# Altium project AGC_AD8317_ADL5330.PrjPcb
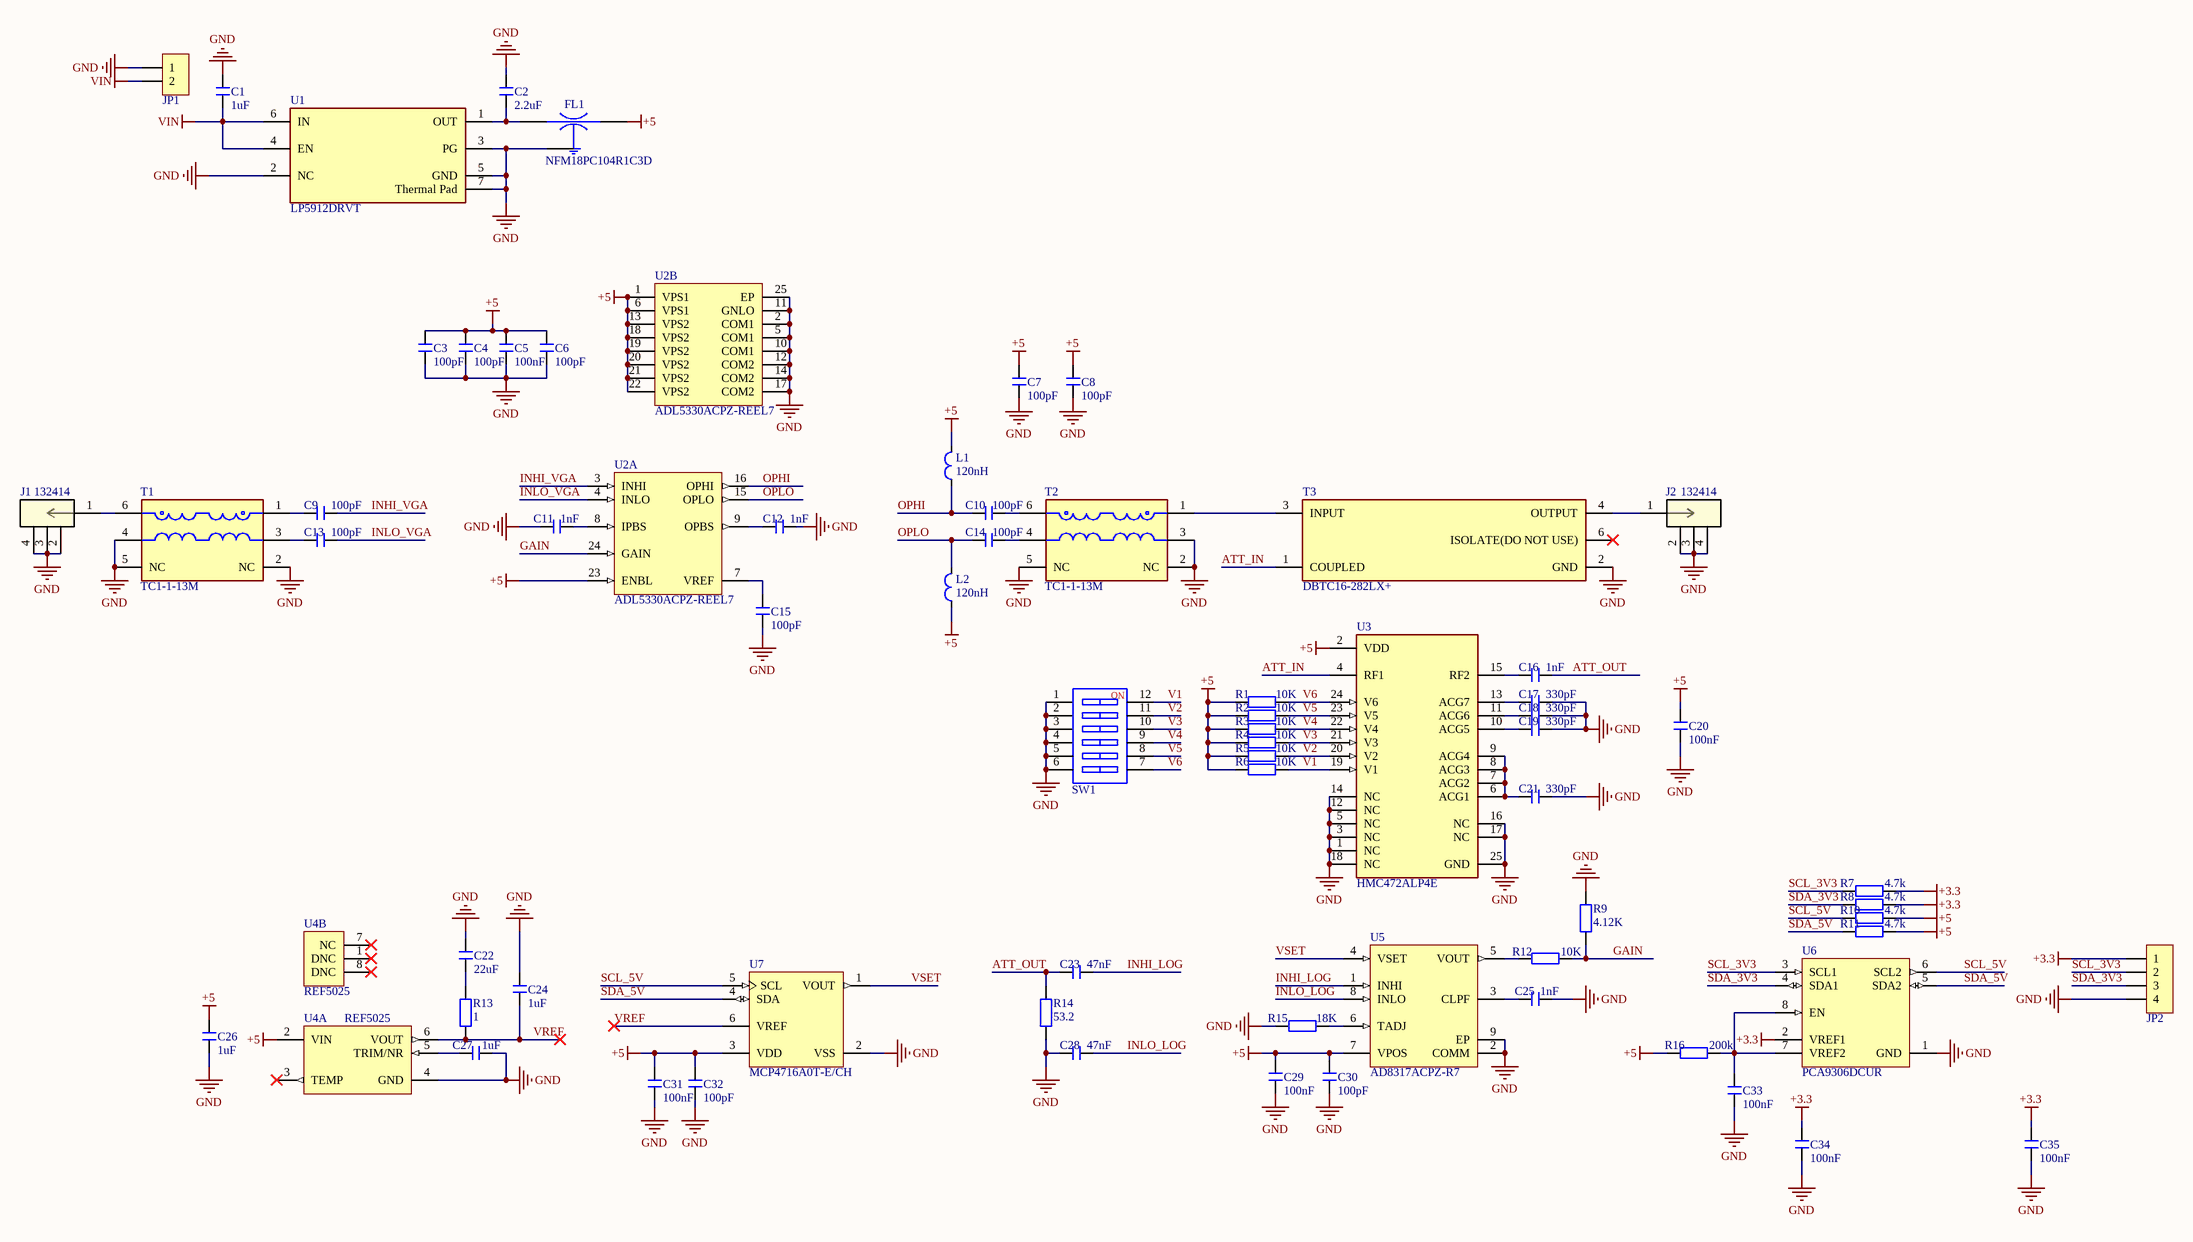
[diagram p0: AGC_AD8317_ADL5330.SchDoc]
1 sheet, 69 parts. Net scope: global (net labels, ports and power ports of the same name join across sheets).
Board file: AGC_AD8317_ADL5330.PcbDoc

## Sheet AGC_AD8317_ADL5330.SchDoc
size A2; SheetNumber: 1; SheetTotal: 1

### Parts
C1  1uF  [C 0402_L]
C2  2.2uF  [C 0603_L]
C3  100pF  [C 0402_L]
C4  100pF  [C 0402_L]
C5  100nF  [C 0402_L]
C6  100pF  [C 0402_L]
C7  100pF  [C 0402_L]
C8  100pF  [C 0402_L]
C9  100pF  [C 0402_L]
C10  100pF  [C 0402_L]
C11  1nF  [C 0402_L]
C12  1nF  [C 0402_L]
C13  100pF  [C 0402_L]
C14  100pF  [C 0402_L]
C15  100pF  [C 0402_L]
C16  1nF  [C 0402_L]
C17  330pF  [C 0402_L]
C18  330pF  [C 0402_L]
C19  330pF  [C 0402_L]
C20  100nF  [C 0402_L]
C21  330pF  [C 0402_L]
C22  22uF  [C 1210_L]
C23  47nF  [C 0402_L]
C24  1uF  [C 0402_L]
C25  1nF  [C 0402_L]
C26  1uF  [C 0402_L]
C27  1uF  [C 0402_L]
C28  47nF  [C 0402_L]
C29  100nF  [C 0402_L]
C30  100pF  [C 0402_L]
C31  100nF  [C 0402_L]
C32  100pF  [C 0402_L]
C33  100nF  [C 0402_L]
C34  100nF  [C 0402_L]
C35  100nF  [C 0402_L]
FL1  NFM18PC104R1C3D  [FIL_NFM18PC104R1C3D]
J1  132414  [CONN_132414_AMP]
J2  132414  [CONN_132414_AMP]
JP1  HDR-1X2  [KF2510-LI-2P]  (value not drawn)
JP2  HDR-1X4  [HDR2.54-LI-4P]  (value not drawn)
L1  120nH  [R 0603_L]
L2  120nH  [R 0603_L]
R1  10K  [R 0402_L]
R2  10K  [R 0402_L]
R3  10K  [R 0402_L]
R4  10K  [R 0402_L]
R5  10K  [R 0402_L]
R6  10K  [R 0402_L]
R7  4.7k  [R 0402_L]
R8  4.7k  [R 0402_L]
R9  4.12K  [R 0402_L]
R10  4.7k  [R 0402_L]
R11  4.7k  [R 0402_L]
R12  10K  [R 0402_L]
R13  1  [R 0402_L]
R14  53.2  [R 0402_L]
R15  18K  [R 0402_L]
R16  200k  [R 0402_L]
SW1  SW-6P  [CSW1.27 SMD-6P]  (value not drawn)
T1  TC1-1-13M  [FP-TC1-1-13M+-MFG]
T2  TC1-1-13M  [FP-TC1-1-13M+-MFG]
T3  DBTC16-282LX+  [FP-DBTC16-282LX+-MFG]
U1  LP5912DRVT  [FP-DRV0006A-MFG]
U2  ADL5330ACPZ-REEL7  [ADI-CP-24-2_L]  (parts A,B of 2)
U3  HMC472ALP4E  [FP-HMC472ALP4E-IPC_A]
U4  REF5025  [D0008A_L]  (parts A,B of 2)
U5  AD8317ACPZ-R7  [ADI-CP-8-1_L]
U6  PCA9306DCUR  [DCU0008A_L]
U7  MCP4716A0T-E/CH  [SOT23-6L]

### Nets
+3.3: C34.2 C35.2 JP2.1 R7.1 R8.1 U6.2(VREF1)
+5: C3.2 C4.2 C5.2 C6.2 C7.2 C8.2 C20.2 C26.2 C29.1 C30.1 C31.2 C32.2 FL1.3(OUT) L1.2 L2.1 R1.1 R2.1 R3.1 R4.1 R5.1 R6.1 R10.1 R11.1 R16.2 U2.1(VPS1) U2.6(VPS1) U2.13(VPS2) U2.18(VPS2) U2.19(VPS2) U2.20(VPS2) U2.21(VPS2) U2.22(VPS2) U2.23(ENBL) U3.2(VDD) U4.2(VIN) U5.7(VPOS) U7.3(VDD)
GND: C1.2 C2.2 C3.1 C4.1 C5.1 C6.1 C7.1 C8.1 C11.1 C12.1 C15.1 C17.2 C18.2 C19.2 C20.1 C21.2 C22.2 C24.2 C25.1 C26.1 C27.2 C28.1 C29.2 C30.2 C31.1 C32.1 C33.1 C34.1 C35.1 FL1.2(GND) J1.2 J1.3 J1.4 J2.2 J2.3 J2.4 JP1.1 JP2.4 R9.1 R14.1 R15.1 SW1.1 SW1.2 SW1.3 SW1.4 SW1.5 SW1.6 T1.2(NC) T1.4(PRIMARY) T1.5(NC) T2.2(NC) T2.3(SECONDARY) T2.5(NC) T3.2(GND) U1.2(NC) U1.3(PG) U1.5(GND) U1.7(Thermal_Pad) U2.2(COM1) U2.5(COM1) U2.10(COM1) U2.11(GNLO) U2.12(COM2) U2.14(COM2) U2.17(COM2) U2.25(EP) U3.1(NC) U3.3(NC) U3.5(NC) U3.12(NC) U3.14(NC) U3.16(NC) U3.17(NC) U3.18(NC) U3.25(GND) U4.4(GND) U5.2(COMM) U5.9(EP) U6.1(GND) U7.2(VSS)
VIN: C1.1 JP1.2 U1.4(EN) U1.6(IN)
ATT_IN: T3.1(COUPLED) U3.4(RF1)
ATT_OUT: C16.2 C23.1 R14.2
GAIN: R9.2 R12.1 U2.24(GAIN)
INHI_LOG: C23.2 U5.1(INHI)
INHI_VGA: C9.2 U2.3(INHI)
INLO_LOG: C28.2 U5.8(INLO)
INLO_VGA: C13.2 U2.4(INLO)
OPHI: C10.1 L1.1 U2.16(OPHI)
OPLO: C14.1 L2.2 U2.15(OPLO)
SCL_3V3: JP2.2 R7.2 U6.3(SCL1)
SCL_5V: R10.2 U6.6(SCL2) U7.5(SCL)
SDA_3V3: JP2.3 R8.2 U6.4(SDA1)
SDA_5V: R11.2 U6.5(SDA2) U7.4(SDA)
V1: R6.2 SW1.12 U3.19(V1)
V2: R5.2 SW1.11 U3.20(V2)
V3: R4.2 SW1.10 U3.21(V3)
V4: R3.2 SW1.9 U3.22(V4)
V5: R2.2 SW1.8 U3.23(V5)
V6: R1.2 SW1.7 U3.24(V6)
VREF: C24.1 R13.1 U4.6(VOUT) U7.6(VREF)
VSET: U5.4(VSET) U7.1(VOUT)
NetC2_1: C2.1 FL1.1(IN) U1.1(OUT)
NetC9_1: C9.1 T1.1(SECONDARY_DOT)
NetC10_2: C10.2 T2.6(PRIMARY_DOT)
NetC11_2: C11.2 U2.8(IPBS)
NetC12_2: C12.2 U2.9(OPBS)
NetC13_1: C13.1 T1.3(SECONDARY)
NetC14_2: C14.2 T2.4(PRIMARY)
NetC15_2: C15.2 U2.7(VREF)
NetC16_1: C16.1 U3.15(RF2)
NetC17_1: C17.1 U3.13(ACG7)
NetC18_1: C18.1 U3.11(ACG6)
NetC19_1: C19.1 U3.10(ACG5)
NetC21_1: C21.1 U3.6(ACG1) U3.7(ACG2) U3.8(ACG3) U3.9(ACG4)
NetC22_1: C22.1 R13.2
NetC25_2: C25.2 U5.3(CLPF)
NetC27_1: C27.1 U4.5(TRIM/NR)
NetC33_2: C33.2 R16.1 U6.7(VREF2) U6.8(EN)
NetJ1_1: J1.1 T1.6(PRIMARY_DOT)
NetJ2_1: J2.1 T3.4(OUTPUT)
NetR12_2: R12.2 U5.5(VOUT)
NetR15_2: R15.2 U5.6(TADJ)
NetT2_1: T2.1(SECONDARY_DOT) T3.3(INPUT)

Not connected (* = marked no-connect by the designer): T3 6(ISOLATE(DO_NOT_USE))*; U4 1(DNC)* 3(TEMP)* 7(NC)* 8(DNC)*

### Notes on the sheet
- (in symbol SW-6P) NO

### Library data of the parts
C1-C35 = C: 贴片电容; 淘宝ID: 小糖豆的小窝窝; BOM名称: 贴片电容; 下单链接: https://item.taobao.com/item.htm?ft=t&id=613637044352
FL1 = NFM18PC104R1C3D: SMD Capacitor with Capacitance: 0.10uF Tol. 20%. Rated Voltage: 16Vdc; MF: Murata; Digi-Key_Part_Number: 490-6969-1-ND; SnapEDA_Link: https://www.snapeda.com/parts/NFM18PC104R1C3D/Murata/view-part/4375738/?ref=snap; Package: NONSTANDARD; MP: NFM18PC104R1C3D; Digi-Key_Purchase_URL: https://www.digikey.com/product-detail/en/murata-electronics/NFM18PC104R1C3D/490-6969-1-ND/3846166?utm_source=snapeda&utm_medium=aggregator&utm_campaign=symbol; Value: *
J1 J2 = 132414: No Description Available; Mfr_Name: Amphenol ICC; Copyright: Copyright (C) 2022 Ultra Librarian. All rights reserved.; Manufacturer_Part_Number: 132414; RefDes: RefDes; Type: DEV
JP1 = Header 2: 2P接插件; 淘宝ID: 小糖豆的小窝窝; BOM名称: 2P接插件; 下单链接: https://item.taobao.com/item.htm?ft=t&id=613637044352
JP2 = Header 4: 4P接插件; 淘宝ID: 小糖豆的小窝窝; BOM名称: 4P接插件; 下单链接: https://item.taobao.com/item.htm?ft=t&id=613637044352
L1 L2 = L-Wire: 高频绕线电感
R1-R16 = R: 贴片电阻; 淘宝ID: 小糖豆的小窝窝; BOM名称: 贴片电阻; 下单链接: https://item.taobao.com/item.htm?ft=t&id=613637044352
SW1 = SW-6P: 6路编码开关; 淘宝ID: 小糖豆的小窝窝; BOM名称: 6路编码开关; 下单链接: https://item.taobao.com/item.htm?ft=t&id=613637044352
T1 T2 = TC1-1-13M: RF Transformer 1: 1 5 Terminal SMD; RoHS Compliant: Yes
T3 = DBTC16-282LX+: 16.8 dB SMT Directional Coupler, 5 - 2850 MHz, 50Ω
U1 = LP5912DRVT: IC REG LINEAR 500MA 6SON; Dropout Voltage: 950mV; Quiescent Current: 30uA; Output Voltage: 3.3V; Number of Regulators: 1; Min Operating Temperature: -40°C; Number of Pins: 6; Max Operating Temperature: 125°C; RoHS Compliant: Yes; Packaging: Tape and Reel; Output Current: 500mA; Mount: Surface Mount; Lead Free: Lead Free
U2 = ADL5330ACPZ: 10 MHz to 3 GHz VGA with 60 dB Gain Control Range, 3GHz, CP-24-2, 1500 Reel, Pb-Free; Output IP3: 31dBm; Gain High End: 22dB; Noise Figure: 14.7dB; Supply Current: 215mA; Gain Low End: -34dB; 1 dB Comp Point: 1.2dBm; PackageDescription: 24-Lead Lead Frame Chip Scale Package [LFCSP_VQ]; ComponentLink1Description: Manufacturer URL; ComponentLink1URL: www.analog.com; ComponentLink3Description: Package Specification; ComponentLink3URL: http://www.analog.com/static/imported-files/packages/588305704543880784658541CP_24_2.pdf; ComponentLink2Description: Datasheet; PackageVersion: Jan-2005; RF Frquency Range (MHz): 3GHz; ComponentLink2URL: http://www.analog.com/static/imported-files/data_sheets/ADL5330.pdf; PackageReference: CP-24-2; Code_JEDEC: MO-220-VGGD-2; DatasheetVersion: Rev. A
U3 = HMC472ALP4E: RF ATTENUATOR 31.5DB 50OHM 24QFN; Manufacturer: Analog Devices; Standoff Height: 0mm; Max Frequency: 3.8GHz; Temperature Range High: +85°C; Ipc Land Pattern Name: QFN50P400X400X90-24; Category: IC; Automotive: No; Package: LFCSP_VQ; Device Class L3: unset; Height: 1mm; Device Class L1: Integrated Circuits (ICs); Octopart: https://octopart.com/hmc472alp4e-analog+devices-51966954; Manufacturer Part Number: HMC472ALP4E; Lead Free: Yes; Device Class L2: RF Semiconductors and Devices; RoHS: TRUE; Footprint Url: https://www.analog.com/media/en/package-pcb-resources/package/pkg_pdf/hittite-legacy-packages/HCP-24-2.pdf; Temperature Range Low: -40°C; Mouser Description: Attenuators 6 Bit 0.5 LSB dig atten; Digikey Description: RF ATTENUATOR 31.5DB 50OHM 24QFN; ComponentLink2URL: https://www.analog.com/media/en/technical-documentation/data-sheets/hmc472a.pdf; Temperature: -40°C to +85°C; ComponentLink2Description: Datasheet
U4 = REF50: Low Noise, Very Low Drift, Precision Voltage Reference, -40 to 125 degC, 8-pin MSOP(DGK), Green (RoHS & no Sb/Br); PartNumber: REF5025AIDGKT; Manufacturer: Texas Instruments; Iout/Iz(Max)(mA): 10; VO(V): 2.5; Rating: Military; Iq(Max)(uA): 1000; SubFamily: Series Voltage Reference; VI(Max)(V): 18; VI(Min)(V): 2.7; Temp Coeff(Max)(ppm/ degree C): 3; Initial Accuracy @ 25/deg C(%): 0.05; Mounting Technology: Surface Mount; ComponentLink3Description: Package Specification; ComponentLink2URL: http://www.ti.com/general/docs/lit/getliterature.tsp?genericPartNumber=REF5025&fileType=pdf; Code_JEDEC: MO-187; PackageVersion: 4073329/E; ComponentLink1URL: http://www.ti.com/; DatasheetVersion: SBOS410E; Eco-Plan: Green (RoHS & no Sb/Br); ComponentLink2Description: Datasheet; ComponentLink3URL: http://www.ti.com/litv/pdf/mpds028d; PackageDescription: 8-Pin Thin Small Outline Package 3 x 3 mm Body ,0.65 mm Pitch; PackageReference: DGK0008A; ComponentLink1Description: Manufacturer URL
U5 = CMP-0284-00065-1: 1 MHz to 10 GHz, 55 dB Log Detector/Controller, 6ns Response Time, CP-8-1, Pb-Free, 3000 Reel; Product Description: Available in Die; Voltage Supply (V): 3 to 5.5; Temp Stability (dB): 500mdB; Dynamic Range (dB): 55dB; Supply Current: 22mA; RF Frequency (MHz): 1 to 10000; ComponentLink1Description: Manufacturer URL; PackageVersion: 031207-A; ComponentLink3Description: Package Specification; ComponentLink3URL: http://www.analog.com/static/imported-files/packages/PKG_PDF/LFCSP(CP)/CP-8/CP_8_1.pdf; ComponentLink1URL: www.analog.com; ComponentLink2URL: http://www.analog.com/static/imported-files/data_sheets/AD8317.pdf; PackageReference: CP-8-1; ComponentLink2Description: Datasheet; DatasheetVersion: Rev. B; Response Time (ns typ): 6ns; PackageDescription: 8-Lead Lead Frame Chip Scale Package [LFCSP_VD]
U6 = CMP-0314-00419-2: Dual Bi-Directional I2C-Bus and SMBus Voltage Level-Translator, 0 to 5.5 V, -40 to 85 degC, 8-pin US8 (DCU), Green (RoHS & no Sb/Br); Manufacturer: Texas Instruments; tpd max(ns): 1.5; Function: Voltage Translator; Enable Pin: Yes; Rating: Catalog; SubFamily: I2C Special Function; Max Frequency(kHz): 400; Vcc range(V): 0 to 5.5; No. of Outputs: 2; PackageVersion: revF, Jul-2005; Eco-Plan: Green (RoHS & no Sb/Br); ComponentLink2Description: Package Specification; ComponentLink1URL: http://www.ti.com/general/docs/lit/getliterature.tsp?genericPartNumber=PCA9306&fileType=pdf; DatasheetVersion: SCPS113J; On-Chip Power-on-Reset: No; PackageDescription: 8-Pin Thin Shrink Small Outline Package 0.5 mm Pitch; Code_JEDEC: MO-187-CA; PackageReference: DCU0008A; 5V Tolerant I/O: Yes; Open Drain I/O Type: Yes; Mounting Technology: Surface Mount; fSCLK(Max)(MHz): 400; PartNumber: PCA9306DCUR; ComponentLink1Description: Datasheet; ComponentLink2URL: http://www.ti.com/litv/pdf/mpds050d
U7 = CMP-0188-01210-1: 10-Bit Voltage Output Digital-to-Analog Converter with EEPROM and I2C Interface, 6-Pin SOT-23, Extended Temperature, Tape and Reel; Code_IPC: SOT26A-6; ComponentLink2Description: Datasheet; DatasheetVersion: revB, Sep-2011; PackageDescription: 6-Lead Plastic Small Outline Transistor (CH) [SOT-23]; ComponentLink2URL: http://ww1.microchip.com/downloads/en/DeviceDoc/22272B.pdf; ComponentLink1URL: http://www.microchip.com/; PackageReference: SOT-23-CH6; ComponentLink1Description: Manufacturer URL; ComponentLink3URL: http://www.microchip.com/stellent/groups/techpub_sg/documents/packagingspec/en012702.pdf; ComponentLink3Description: Package Specification; PackageVersion: revBB, Aug-2009